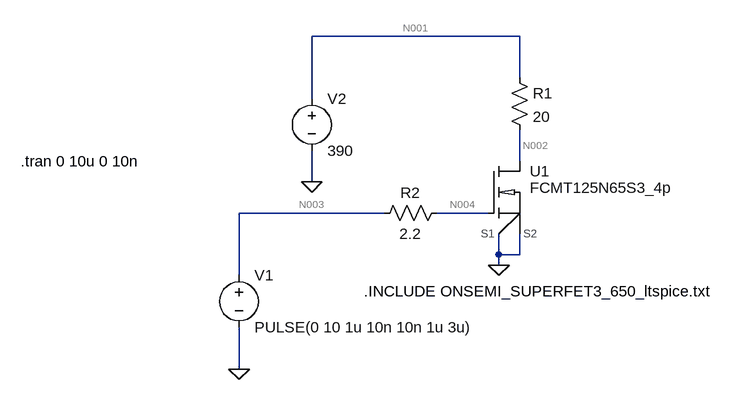
[diagram p0: schematic ONSemiTest.asc]
ONSemiTest.asc, the LTspice schematic file:
Version 4
SHEET 1 880 680
WIRE 240 -176 -80 -176
WIRE 240 -112 240 -176
WIRE -80 -80 -80 -176
WIRE 240 16 240 -32
WIRE -80 48 -80 0
WIRE 32 96 -192 96
WIRE 192 96 112 96
WIRE 208 160 208 128
WIRE 240 160 240 128
WIRE 240 160 208 160
WIRE 208 176 208 160
WIRE -192 192 -192 96
WIRE -192 336 -192 272
FLAG 208 176 0
FLAG -192 336 0
FLAG -80 48 0
SYMBOL Onsemi\\FCMT125N65S3_4p 192 16 R0
SYMATTR InstName U1
SYMBOL voltage -192 176 R0
WINDOW 123 0 0 Left 0
WINDOW 39 0 0 Left 0
SYMATTR InstName V1
SYMATTR Value PULSE(0 10 1u 10n 10n 1u 3u)
SYMBOL res 224 -128 R0
SYMATTR InstName R1
SYMATTR Value 20
SYMBOL voltage -80 -96 R0
WINDOW 123 0 0 Left 0
WINDOW 39 0 0 Left 0
SYMATTR InstName V2
SYMATTR Value 390
SYMBOL res 128 80 R90
WINDOW 0 0 56 VBottom 2
WINDOW 3 32 56 VTop 2
SYMATTR InstName R2
SYMATTR Value 2.2
TEXT 0 216 Left 2 !.INCLUDE ONSEMI_SUPERFET3_650_ltspice.txt
TEXT -528 16 Left 2 !.tran 0 10u 0 10n

The netlist it stands for:
* ONSemiTest.asc
XU1 N002 N004 0 0 FCMT125N65S3_4p  ; pins D G S1 S2
V1 N003 0 PULSE(0 10 1u 10n 10n 1u 3u)
R1 N001 N002 20
V2 N001 0 390
R2 N004 N003 2.2
.INCLUDE ONSEMI_SUPERFET3_650_ltspice.txt
.tran 0 10u 0 10n
.backanno
.end

* Results of the author's LTspice run, read from the files saved beside the schematic
* Operating Point, zero values left out:
*   V(n002) = 390 V
*   V(n001) = 390 V
*   I(R1) = 6.983 µA
*   I(V2) = -6.983 µA
*   Ix(u1:D) = 6.983 µA
*   Ix(u1:S2) = -6.968 µA
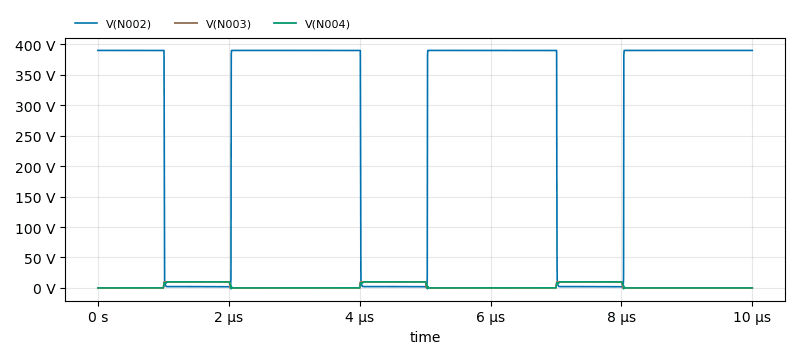
[diagram p1: Transient Analysis of ONSemiTest.asc, plotted from the saved traces]
* Transient Analysis, 1 run:
*   V(N002): min 1.761 V, max 390.1 V, average 271.3 V, rms 324.7 V, last 390 V
*   V(N003): min 0 V, max 10 V, average 3.03 V, rms 5.496 V, last 0 V
*   V(N004): min -1.423 V, max 10 V, average 3.031 V, rms 5.464 V, last 0 V